# EAGLE design North_Paw_V2p1 (EAGLE 6.5.0)
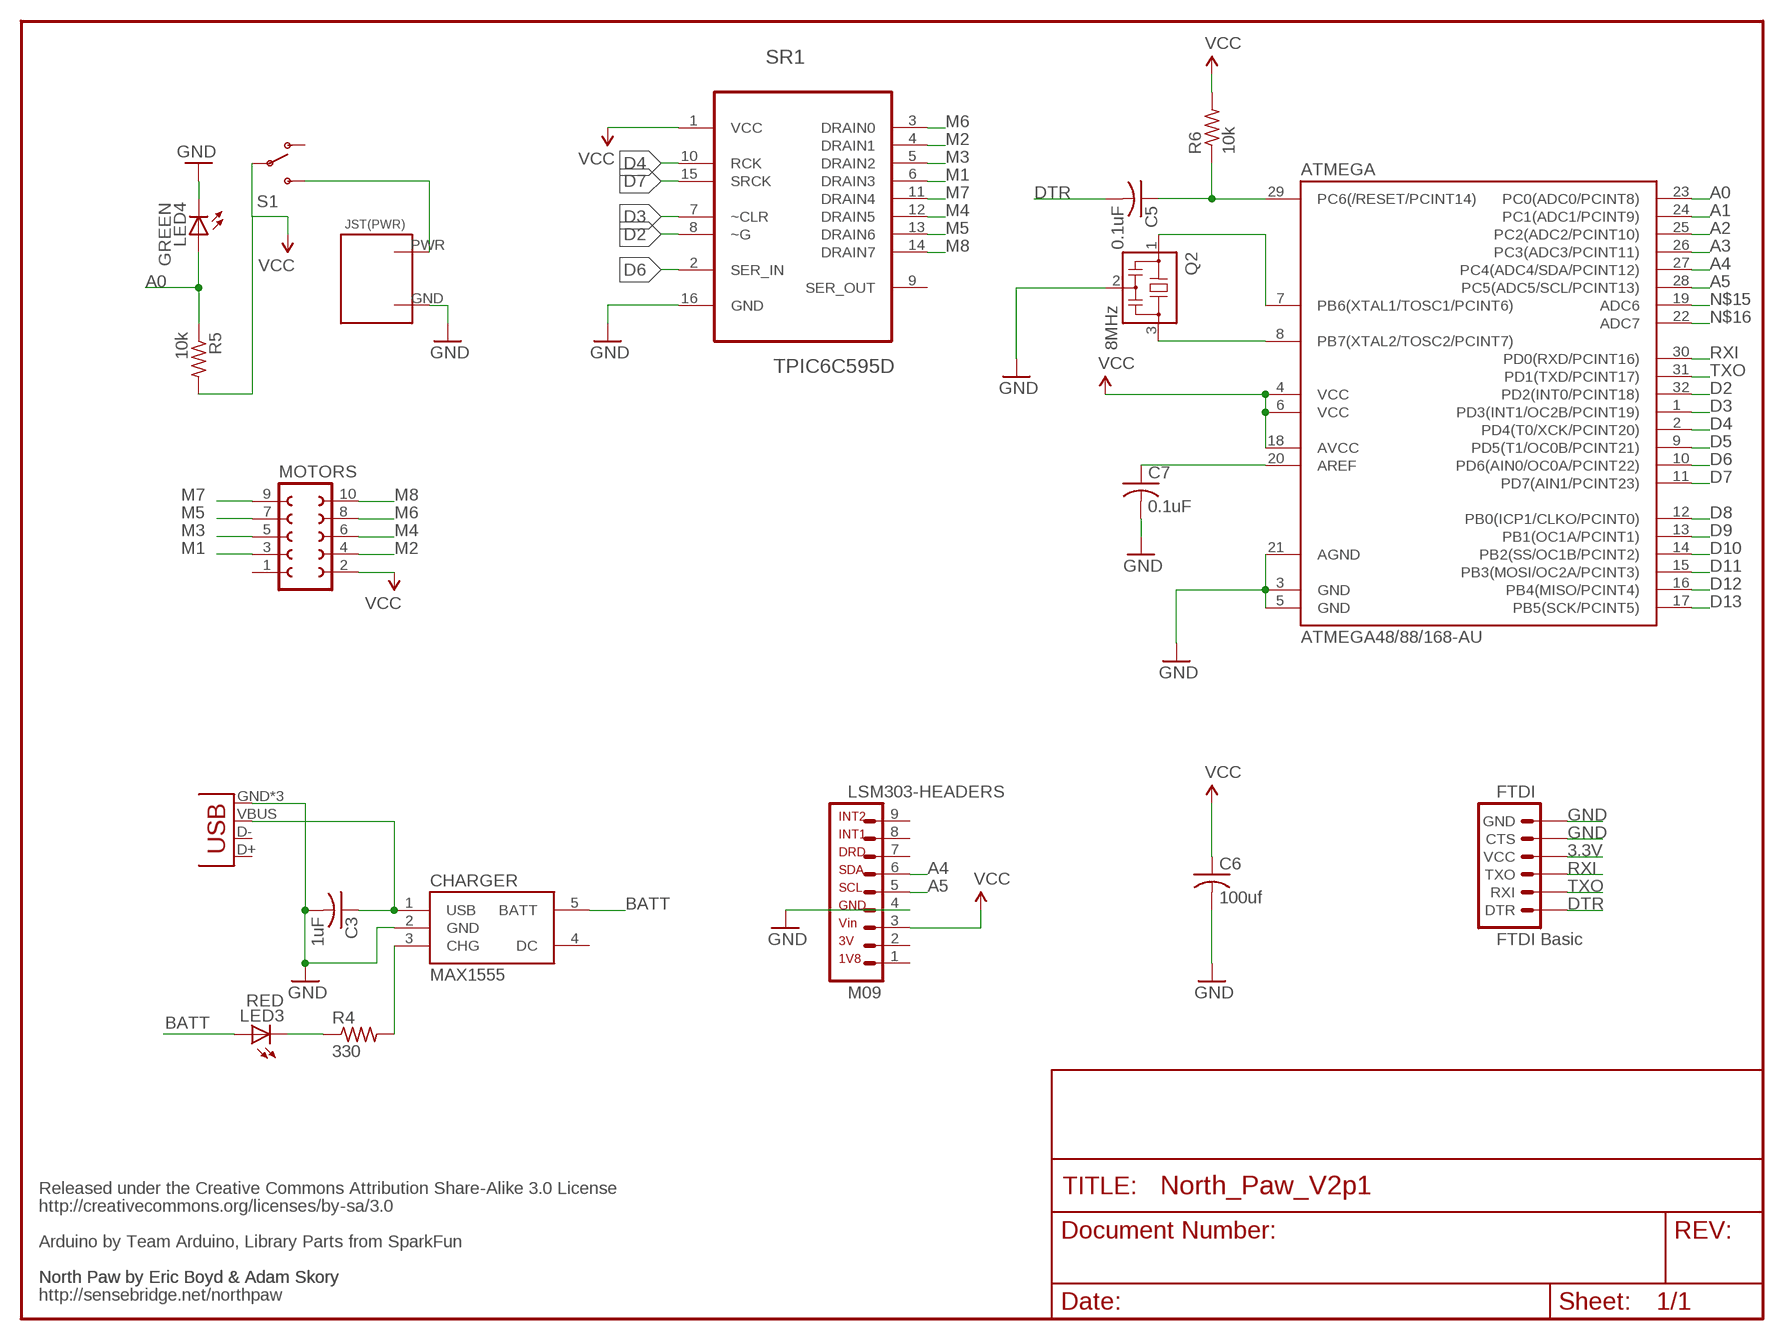
[diagram p0: schematic, sheet 1]

## Parts
ATMEGA  ATMEGA48/88/168-AU  [TQFP32-08]
C3  1uF  C-USC0805  [C0805]
C5  0.1uF  C-USC0805  [C0805]
C6  100uf  C-USC0805  [C0805]
C7  0.1uF  C-USC0805  [C0805]
CHARGER  MAX1555  [SOT23-5]
FTDI  FTDI Basic  ARDUINO_SERIAL_PROGRAMPTH  [1X06]
JP1  USB-MICROB  [USB-MICROB]
JST(PWR)  S2B-PH-K-S  [S4B-ZR]
LED3  RED  LEDCHIP-LED0805  [CHIP-LED0805]
LED4  GREEN  LEDCHIP-LED0805  [CHIP-LED0805]
LSM303-HEADERS  M09  MA09-1W  [MA09-1W]
MOTORS  FE05-2  [FE05-2]
Q2  8MHz  CSTCR6M00G53Z  [CSTCR6M]
R4  330  R-US_R0805  [R0805]
R5  10k  R-US_R0805  [R0805]
R6  10k  R-US_R0805  [R0805]
S1  SWITCH-SPDT-SMD-A  [SWITCH-SPST-SMD-A]
SR1  TPIC6C595D  [SOIC127P600X175-16N]

## Nets
3.3V [ground]: ATMEGA.4(VCC) ATMEGA.6(VCC) ATMEGA.18(AVCC) C6.1 FTDI.4(VCC) LSM303-HEADERS.3 MOTORS.2 R5.2 R6.2 S1.2(P) SR1.1(VCC) ; supply symbol labelled VCC
A0: ATMEGA.23(PC0(ADC0/PCINT8)) LED4.A R5.1
A1: ATMEGA.24(PC1(ADC1/PCINT9))
A2: ATMEGA.25(PC2(ADC2/PCINT10))
A3: ATMEGA.26(PC3(ADC3/PCINT11))
A4: ATMEGA.27(PC4(ADC4/SDA/PCINT12)) LSM303-HEADERS.6
A5: ATMEGA.28(PC5(ADC5/SCL/PCINT13)) LSM303-HEADERS.5
BATT [power]: CHARGER.5(BATT) LED3.A
D2: ATMEGA.32(PD2(INT0/PCINT18)) SR1.8(~G)
D3: ATMEGA.1(PD3(INT1/OC2B/PCINT19)) SR1.7(~CLR)
D4: ATMEGA.2(PD4(T0/XCK/PCINT20)) SR1.10(RCK)
D5: ATMEGA.9(PD5(T1/OC0B/PCINT21))
D6: ATMEGA.10(PD6(AIN0/OC0A/PCINT22)) SR1.2(SER_IN)
D7: ATMEGA.11(PD7(AIN1/PCINT23)) SR1.15(SRCK)
D8: ATMEGA.12(PB0(ICP1/CLKO/PCINT0))
D9: ATMEGA.13(PB1(OC1A/PCINT1))
D10: ATMEGA.14(PB2(SS/OC1B/PCINT2))
D11: ATMEGA.15(PB3(MOSI/OC2A/PCINT3))
D12: ATMEGA.16(PB4(MISO/PCINT4))
D13: ATMEGA.17(PB5(SCK/PCINT5))
DTR: C5.2 FTDI.1(DTR)
GND [ground]: ATMEGA.3(GND) ATMEGA.5(GND) ATMEGA.21(AGND) C3.2 C6.2 C7.2 CHARGER.2(GND) FTDI.5(CTS) FTDI.6(GND) JP1.GND JP1.MT1(GND) JP1.MT2(GND) JST(PWR).GND LED4.C LSM303-HEADERS.4 Q2.2 SR1.16(GND)
M1: MOTORS.3 SR1.6(DRAIN3)
M2: MOTORS.4 SR1.4(DRAIN1)
M3: MOTORS.5 SR1.5(DRAIN2)
M4: MOTORS.6 SR1.12(DRAIN5)
M5: MOTORS.7 SR1.13(DRAIN6)
M6: MOTORS.8 SR1.3(DRAIN0)
M7: MOTORS.9 SR1.11(DRAIN4)
M8: MOTORS.10 SR1.14(DRAIN7)
N$1: ATMEGA.7(PB6(XTAL1/TOSC1/PCINT6)) Q2.1
N$2: ATMEGA.8(PB7(XTAL2/TOSC2/PCINT7)) Q2.3
N$3: ATMEGA.20(AREF) C7.1
N$4: JST(PWR).PWR S1.3(S)
N$7: CHARGER.3(CHG) R4.2
N$8: LED3.C R4.1
N$15: ATMEGA.19(ADC6)
N$16: ATMEGA.22(ADC7)
RESET: ATMEGA.29(PC6(/RESET/PCINT14)) C5.1 R6.1
RXI: ATMEGA.30(PD0(RXD/PCINT16)) FTDI.3(TXO)
TXO: ATMEGA.31(PD1(TXD/PCINT17)) FTDI.2(RXI)
USB_VIN: C3.1 CHARGER.1(USB) JP1.VBUS
Unconnected: CHARGER.4(DC) JP1.D+ JP1.D- LSM303-HEADERS.1 LSM303-HEADERS.2 LSM303-HEADERS.7 LSM303-HEADERS.8 LSM303-HEADERS.9 MOTORS.1 S1.1(O) SR1.9(SER_OUT)

## Notes on the sheet
- Released under the Creative Commons Attribution Share-Alike 3.0 License
- http://creativecommons.org/licenses/by-sa/3.0
- Arduino by Team Arduino, Library Parts from SparkFun
- North Paw by Eric Boyd & Adam Skory | North Paw by Eric Boyd & Adam Skory
- http://sensebridge.net/northpaw

## Library data of the parts
ATMEGA = atmega8:ATMEGA48/88/168; OC_NEWARK: unknown
C3 = adafruit:C-US: CAPACITOR, American symbol; MF: KEMET; MPN: C0805C105K4RACTU; OC_NEWARK: 70K9137
C5 C7 = adafruit:C-US: CAPACITOR, American symbol; MPN: C0805C104K3RACTU; OC_NEWARK: 54K3711
C6 = adafruit:C-US: CAPACITOR, American symbol; MPN: TLCR107M004XTA; OC_NEWARK: 59M9595
CHARGER = SparkFun:MAX1555: MAX1555 Lithium Charger IC SOT-23 Lithium Polymer charging IC. Schematic element and footprint proven. Spark Fun Electronics SKU : COM-00674; MPN: MAX1555EZK+T.; OC_NEWARK: 26R6103
FTDI = SparkFun:ARDUINO_SERIAL_PROGRAM; OC_NEWARK: unknown
JP1 = SparkFun-Connectors:USB: USB Connectors USB-B-PTH is fully proven SKU : PRT-00139/CONN-08278 USB-miniB is fully proven SKU : PRT-00587 USB-A-PCB is untested. USB-A-H is throughly reviewed, but untested. Spark Fun Electronics SKU : PRT-00437 USB-B-SMT is throughly reviewed, but untested. Needs silkscreen touching up. USB-A-S has not been used/tested USB-MB-H has not been used/tested USB-MICROB has been used. CONN-09505; OC_NEWARK: unknown; PROD_ID: CONN-09505
JST(PWR) = North_Paw:S2B-PH-K-S; OC_NEWARK: unknown
LED3 = adafruit:LED: LED OSRAM: - CHIPLED LG R971, LG N971, LY N971, LG Q971, LY Q971, LO R971, LY R971 LH N974, LH R974 LS Q976, LO Q976, LY Q976 LO Q996 - Hyper CHIPLED LW Q18S LB Q993, LB Q99A, LB R99A - SideLED LS A670, LO A670, LY A670, LG A670, LP A670 LB A673, LV A673, LT A673, LW A673 LH A674 LY A675 LS A676, LA A676, LO A676, LY A676, LW A676 LS A679, LY A679, LG A679 - Hyper Micro SIDELED® LS Y876, LA Y876, LO Y876, LY Y876 LT Y87S - SmartLED LW L88C, LW L88S LB L89C, LB L89S, LG L890 LS L89K, LO L89K, LY L89K LS L896, LA L896, LO L896, LY L896 - TOPLED LS T670, LO T670, LY T670, LG T670, LP T670 LSG T670, LSP T670, LSY T670, LOP T670, LYG T670 LG T671, LOG T671, LSG T671 LB T673, LV T673, LT T673, LW T673 LH T674 LS T676, LA T676, LO T676, LY T676, LB T676, LH T676, LSB T676, LW T676 LB T67C, LV T67C, LT T67C, LS T67K, LO T67K, LY T67K, LW E67C LS E67B, LA E67B, LO E67B, LY E67B, LB E67C, LV E67C, LT E67C LW T67C LS T679, LY T679, LG T679 LS T770, LO T770, LY T770, LG T770, LP T770 LB T773, LV T773, LT T773, LW T773 LH T774 LS E675, LA E675, LY E675, LS T675 LS T776, LA T776, LO T776, LY T776, LB T776 LHGB T686 LT T68C, LB T68C - Hyper Mini TOPLED® LB M676 - Mini TOPLED Santana® LG M470 LS M47K, LO M47K, LY M47K Source: http://www.osram.convergy.de/; MPN: 150080RS75000; OC_NEWARK: 95W3801
LED4 = adafruit:LED: LED OSRAM: - CHIPLED LG R971, LG N971, LY N971, LG Q971, LY Q971, LO R971, LY R971 LH N974, LH R974 LS Q976, LO Q976, LY Q976 LO Q996 - Hyper CHIPLED LW Q18S LB Q993, LB Q99A, LB R99A - SideLED LS A670, LO A670, LY A670, LG A670, LP A670 LB A673, LV A673, LT A673, LW A673 LH A674 LY A675 LS A676, LA A676, LO A676, LY A676, LW A676 LS A679, LY A679, LG A679 - Hyper Micro SIDELED® LS Y876, LA Y876, LO Y876, LY Y876 LT Y87S - SmartLED LW L88C, LW L88S LB L89C, LB L89S, LG L890 LS L89K, LO L89K, LY L89K LS L896, LA L896, LO L896, LY L896 - TOPLED LS T670, LO T670, LY T670, LG T670, LP T670 LSG T670, LSP T670, LSY T670, LOP T670, LYG T670 LG T671, LOG T671, LSG T671 LB T673, LV T673, LT T673, LW T673 LH T674 LS T676, LA T676, LO T676, LY T676, LB T676, LH T676, LSB T676, LW T676 LB T67C, LV T67C, LT T67C, LS T67K, LO T67K, LY T67K, LW E67C LS E67B, LA E67B, LO E67B, LY E67B, LB E67C, LV E67C, LT E67C LW T67C LS T679, LY T679, LG T679 LS T770, LO T770, LY T770, LG T770, LP T770 LB T773, LV T773, LT T773, LW T773 LH T774 LS E675, LA E675, LY E675, LS T675 LS T776, LA T776, LO T776, LY T776, LB T776 LHGB T686 LT T68C, LB T68C - Hyper Mini TOPLED® LB M676 - Mini TOPLED Santana® LG M470 LS M47K, LO M47K, LY M47K Source: http://www.osram.convergy.de/; MPN: 150080GS75000; OC_NEWARK: 95W3800
LSM303-HEADERS = North_Paw:MA09-1W: PIN HEADER; OC_NEWARK: unknown
MOTORS = North_Paw:FE05-2: FEMALE HEADER; OC_NEWARK: unknown
Q2 = murata-filter:CSTCR: Resonator Source: murata.co.jp; MPN: CSTCR6M00G53-R0; OC_FARNELL: 1170434; OC_NEWARK: 25M8759
R4 = adafruit:R-US_: RESISTOR, American symbol; MPN: CRCW0805330RJNEA; OC_NEWARK: 59M6894
R5 R6 = adafruit:R-US_: RESISTOR, American symbol; MF: VISHAY/DALE; MPN: CRCW080510K0FKTA; OC_NEWARK: 05F1511
S1 = SparkFun-Electromechanical:SWITCH-SPDT: SPDT Switch Simple slide switch, Spark Fun Electronics SKU : COM-00102 DPDT SMT slide switch, AYZ0202, SWCH-08179; OC_NEWARK: unknown
SR1 = Texas Instruments_By_element14_Batch_1:TPIC6C595D: POWER LOGIC 8BIT SHIFT REGISTER; MF: TEXAS INSTRUMENTS; MPN: TPIC6C595D; OC_FARNELL: 1651926; OC_NEWARK: 96B3624; PACKAGE: SOIC-16; SUPPLIER: TI

## Net classes
0 default: width 0.381 mm, drill 0.508 mm, clearance 0.381 mm
1 power: width 0.508 mm, drill 0.508 mm, clearance 0.381 mm
2 ground: width 0.508 mm, drill 0.508 mm, clearance 0.381 mm

## Board
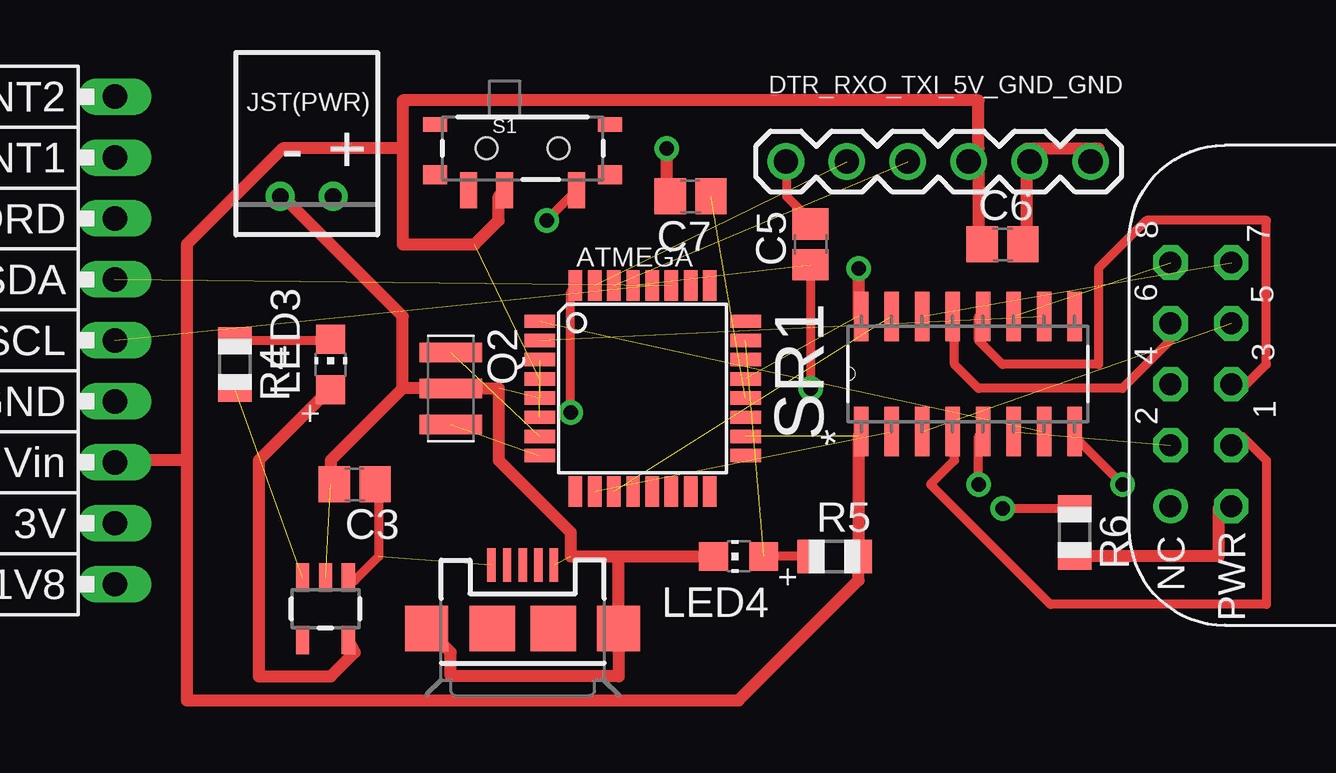
[diagram p1: board, top side]
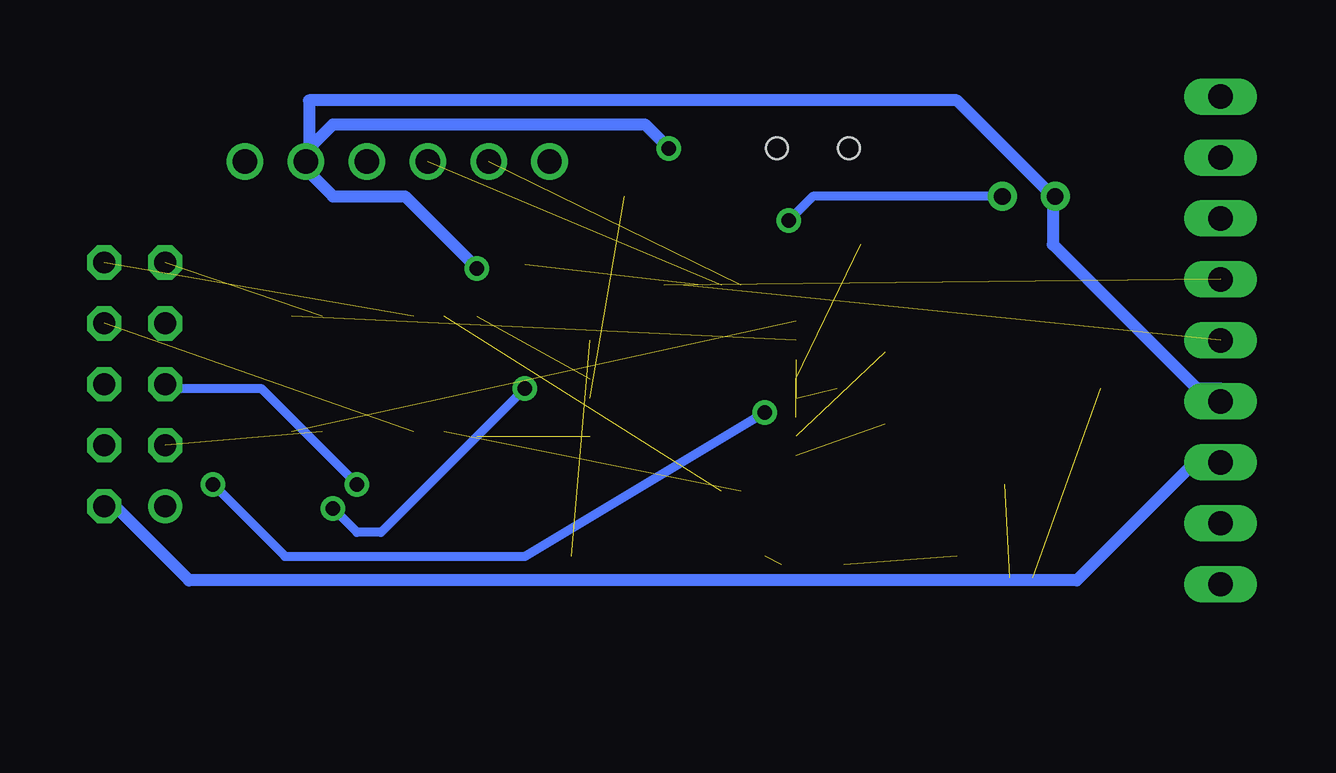
[diagram p2: board, bottom side, seen from below]

No outline drawn. Coordinates in mm, seen from the top.
Copper layers (1*16): Top 0.035mm / dielectric 1.5mm / Bottom 0.035mm
Design rules "default *": minimum track width 8mil, minimum drill 24mil, track to track 8mil, track to pad 6mil, pad to pad 6mil, via to via 6mil, smd to smd 6mil, copper to edge 40mil, drill to drill 8mil, minimum pad ring 10mil, minimum via ring 8mil, stop-mask expansion 4mil, vias tented up to drill 0mil, thermal gap 10mil

### Footprints (pad centres in the part's own frame; a part is rotated, then mirrored left to right if it is on the bottom)
TQFP32-08 = smd 1.27 x 0.559: 1 -4.293,2.8; 2 -4.293,2; 3 -4.293,1.2; 4 -4.293,0.4; 5 -4.293,-0.4; 6 -4.293,-1.2; 7 -4.293,-2; 8 -4.293,-2.8; 17 4.293,-2.8; 18 4.293,-2; 19 4.293,-1.2; 20 4.293,-0.4; 21 4.293,0.4; 22 4.293,1.2; 23 4.293,2; 24 4.293,2.8 | smd 0.559 x 1.27: 9 -2.8,-4.293; 10 -2,-4.293; 11 -1.2,-4.293; 12 -0.4,-4.293; 13 0.4,-4.293; 14 1.2,-4.293; 15 2,-4.293; 16 2.8,-4.293; 25 2.8,4.293; 26 2,4.293; 27 1.2,4.293; 28 0.4,4.293; 29 -0.4,4.293; 30 -1.2,4.293; 31 -2,4.293; 32 -2.8,4.293
C0805 = smd 1.3 x 1.5: 1 -0.85,0; 2 0.85,0
SOT23-5 = smd 0.55 x 1.2: 1 -0.95,-1.3; 2 0,-1.3; 3 0.95,-1.3; 4 0.95,1.3; 5 -0.95,1.3
1X06 = drill 1.016: 1 0,0; 2 2.54,0; 3 5.08,0; 4 7.62,0; 5 10.16,0; 6 12.7,0
USB-MICROB = smd 0.35 x 1.4: D+ 0,2.65; D- -0.65,2.65; GND 1.3,2.65; ID 0.65,2.65; VBUS -1.3,2.65 | smd 1.8 x 1.9: MT1 -4,0; MT2 4,0 | smd 1.9 x 1.9: P$1 -1.27,0; P$2 1.27,0
S4B-ZR = drill 0.7 pad 1.15: GND 1.1,0; PWR -1.1,0
CHIP-LED0805 = smd 1.2 x 1.2: A 0,-1.05; C 0,1.05
MA09-1W = drill 1.016 long: 1 -10.16,0; 2 -7.62,0; 3 -5.08,0; 4 -2.54,0; 5 0,0; 6 2.54,0; 7 5.08,0; 8 7.62,0; 9 10.16,0
FE05-2 = drill 0.914: 1 5.05,-6.27 | drill 0.914 octagon: 2 5.05,-3.73; 3 2.51,-6.27; 4 2.51,-3.73; 5 -0.03,-6.27; 6 -0.03,-3.73; 7 -2.57,-6.27; 8 -2.57,-3.73; 9 -5.11,-6.27; 10 -5.11,-3.73
CSTCR6M = smd 0.8 x 2.6: 1 -1.5,0; 2 0,0; 3 1.5,0
R0805 = smd 1.1 x 1.4: 1 -1,0; 2 1,0
SWITCH-SPST-SMD-A = smd 0.7 x 1.5: 1 -2.25,-1.75; 2 -0.75,-1.75; 3 2.25,-1.75 | smd 1 x 0.6: GND1 -3.65,1; GND3 3.65,1 | smd 1 x 0.8: GND2 -3.65,-1.1; GND4 3.65,-1.1 | hole 0.9: -1.5,0; 1.5,0
SOIC127P600X175-16N = smd 2.057 x 0.61: 1 -4.801,8.89; 2 -4.801,7.62; 3 -4.801,6.35; 4 -4.801,5.08; 5 -4.801,3.81; 6 -4.801,2.54; 7 -4.801,1.27; 8 -4.801,0; 9 0,0; 10 0,1.27; 11 0,2.54; 12 0,3.81; 13 0,5.08; 14 0,6.35; 15 0,7.62; 16 0,8.89

### Placement (x,y rotation side)
ATMEGA  66,23 0 top
C3  54,19 180 top
C5  73,29 90 top
C6  81,29 0 top
C7  68,31 180 top
CHARGER  52.78,13.82 180 top
FTDI  71.97,32.45 0 top
JP1  61,13 0 top
JST(PWR)  52,31 180 top
LED3  53,24 0 top
LED4  70,16 90 top
LSM303-HEADERS  44,25 90 top
MOTORS  94.27,23.14 270 top
Q2  58,23 270 top
R4  49,24 270 top
R5  74,16 0 top
R6  84,17 270 top
S1  61,33 0 top
SR1  84,26 90 top

### Tracks (layer width: path | path; a pad name or v marks a point on that pad's centre or on a via)
3.3V  (3 unrouted)
  Top 0.508: R6.2 90,16 90,18 MOTORS.2 | SR1.1 75,21 R5.2 75,15 70,10 47,10 47,20 | 56,33 56,35 80,35 80,33 FTDI.4 80,32 80,29 C6.1 | 56,33 56,29 59,29 60,30 60,31 S1.2 | 47,20 44,20 LSM303-HEADERS.3 | 47,20 47,29 51,33 56,33
  Bottom 0.508: MOTORS.2 90,18 87,15 50,15 45,20 44,20 LSM303-HEADERS.3
A0  (1 unrouted)
  Top 0.381: R5.1 LED4.A 71,16
A4  (1 unrouted)
A5  (1 unrouted)
BATT
  Top 0.508: CHARGER.5 54,12 53,11 50,11 50,20 53,23 LED3.A
D2  (via drill 0.61)
  Top 0.381: v63,22 63,27 ATMEGA.32 | v86,19 84,21 SR1.8
  Bottom 0.381: v63,22 73,16 83,16 v86,19
D3  (1 unrouted)
D4  (1 unrouted)
D6  (1 unrouted)
D7  (1 unrouted)
DTR
  Top 0.381: C5.2 73,30 72,31 72,32 FTDI.1
GND  (via drill 0.61)  (5 unrouted)
  Top 0.508: v67,33 67,31 C7.2 | C6.2 82,29 82,32 FTDI.5 82,33 85,33 FTDI.6 | v75,28 75,26 SR1.16 | 65,16 LED4.C 69,16 | 65,16 JP1.MT2 65,11 58,11 58,12 JP1.MT1 | 56,23 53,20 53,19 C3.2 | 56,23 Q2.2 60,23 60,20 63,17 63,16 65,16 | 56,23 56,26 51,31 JST(PWR).GND
  Bottom 0.508: v67,33 68,34 81,34 82,33 | v75,28 78,31 81,31 82,32 FTDI.5 82,33 | 51,31 51,29 45,23 44,23 LSM303-HEADERS.4 | 82,33 82,35 55,35 51,31 | 51,31 JST(PWR).GND
M1  (1 unrouted)
M2
  Top 0.381: SR1.4 79,21 79,20 78,19 83,14 92,14 92,20 91,21 MOTORS.4
M3  (via drill 0.61)
  Top 0.381: v80,19 80,21 SR1.5
  Bottom 0.381: v80,19 84,23 88,23 MOTORS.5
M4
  Top 0.381: SR1.12 80,26 80,25 81,24 85,24 85,28 87,30 92,30 92,24 91,23 MOTORS.6
M5
  Top 0.381: SR1.13 79,26 79,24 80,23 86,23 88,25 MOTORS.7
M6  (1 unrouted)
M7  (1 unrouted)
M8  (1 unrouted)
N$1  (1 unrouted)
N$2  (1 unrouted)
N$3  (1 unrouted)
N$4  (via drill 0.61)
  Top 0.381: v62,30 S1.3
  Bottom 0.381: v62,30 61,31 JST(PWR).PWR 53,31
N$7  (1 unrouted)
N$8
  Top 0.381: R4.1 53,25 LED3.C
RESET  (via drill 0.61)  (1 unrouted)
  Top 0.381: v81,18 R6.1 | C5.1 v73,23
  Bottom 0.381: v81,18 80,17 79,17 v73,23
RXI  (1 unrouted)
TXO  (1 unrouted)
USB_VIN  (1 unrouted)
  Top 0.381: CHARGER.1 54,15 55,16 55,19 C3.1

### Text on the board
tPlace: DTR_RXO_TXI_5V_GND_GND